# EAGLE design stm32f4discovery-daugherboard-v2 (EAGLE 6.2)
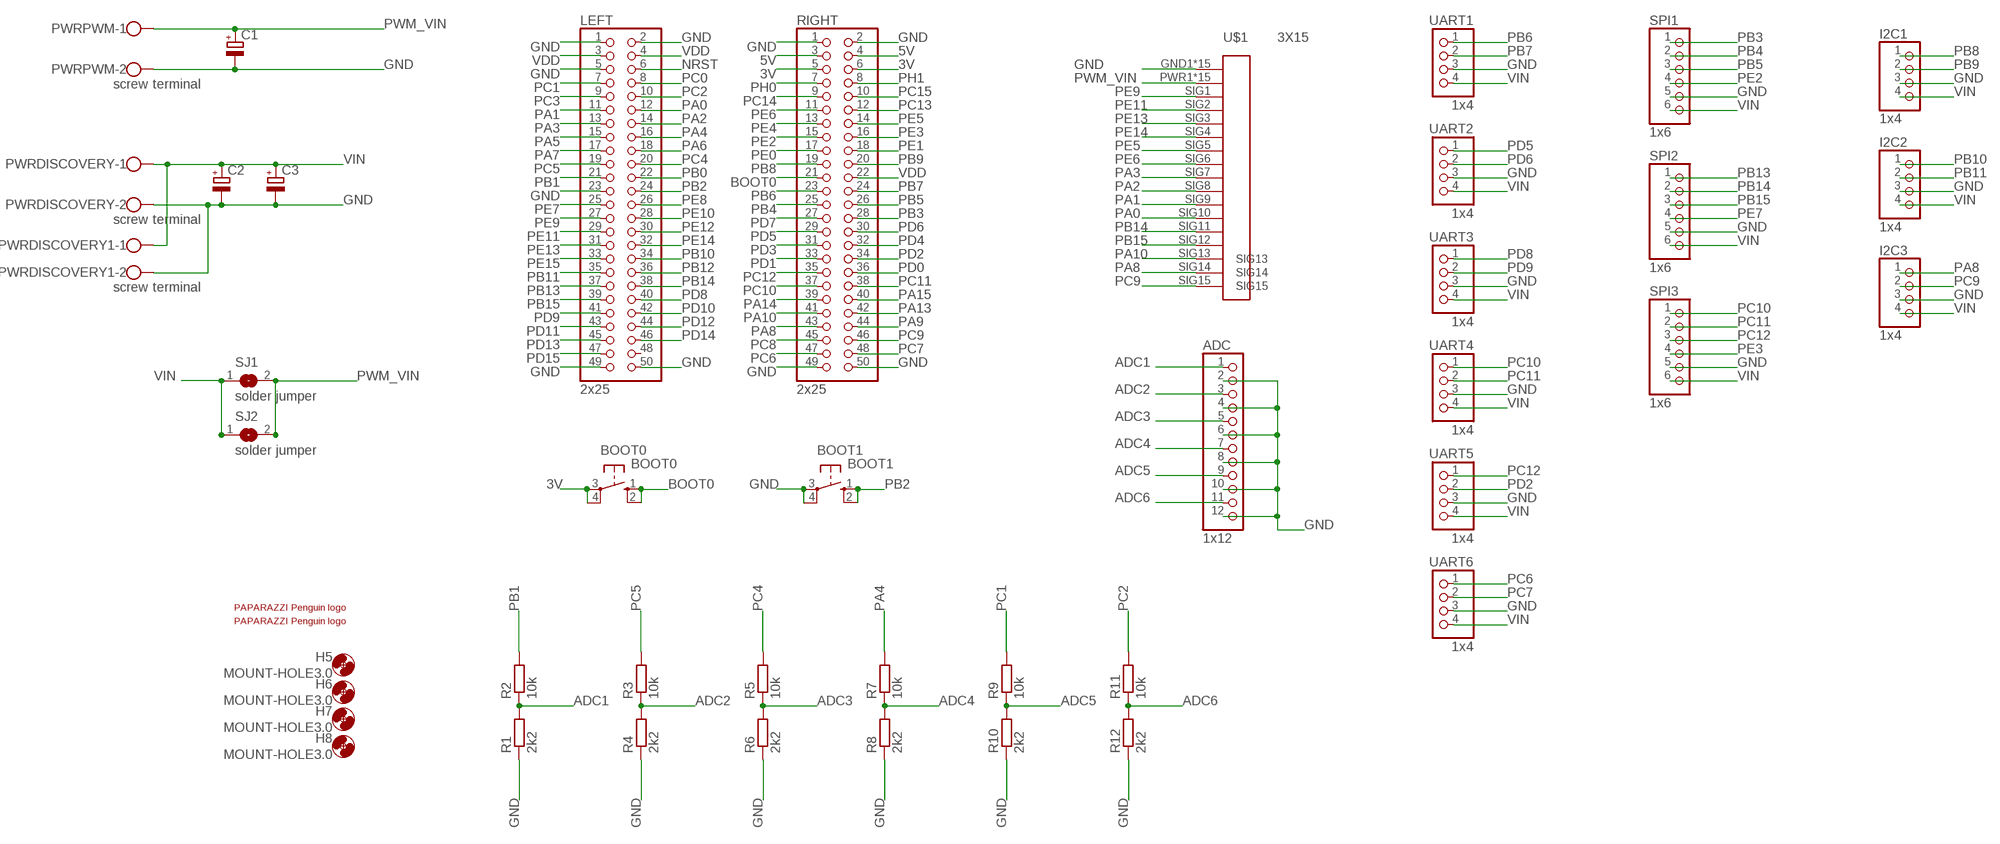
[diagram p0: schematic, sheet 1]

## Parts
ADC  1x12  PINHD-1X12/90  [1X12/90]
BOOT0  BOOT0  10-XX  [B3F-10XX]
BOOT1  BOOT1  10-XX  [B3F-10XX]
C1  CPOL-EU153CLV-0807  [153CLV-0807]
C2  CPOL-EU153CLV-0807  [153CLV-0807]
C3  CPOL-EU153CLV-0807  [153CLV-0807]
H5  MOUNT-HOLE3.0  [3,0]
H6  MOUNT-HOLE3.0  [3,0]
H7  MOUNT-HOLE3.0  [3,0]
H8  MOUNT-HOLE3.0  [3,0]
I2C1  1x4  PINHD-1X4/90  [1X04/90]
I2C2  1x4  PINHD-1X4/90  [1X04/90]
I2C3  1x4  PINHD-1X4/90  [1X04/90]
LEFT  2x25  PINHD-2X25  [2X25]
PWRDISCOVERY  screw terminal  W237-102  [W237-102]
PWRDISCOVERY1  screw terminal  W237-102  [W237-102]
PWRPWM  screw terminal  W237-102  [W237-102]
R1  2k2  R-EU_M0805  [M0805]
R2  10k  R-EU_M0805  [M0805]
R3  10k  R-EU_M0805  [M0805]
R4  2k2  R-EU_M0805  [M0805]
R5  10k  R-EU_M0805  [M0805]
R6  2k2  R-EU_M0805  [M0805]
R7  10k  R-EU_M0805  [M0805]
R8  2k2  R-EU_M0805  [M0805]
R9  10k  R-EU_M0805  [M0805]
R10  2k2  R-EU_M0805  [M0805]
R11  10k  R-EU_M0805  [M0805]
R12  2k2  R-EU_M0805  [M0805]
RIGHT  2x25  PINHD-2X25  [2X25]
SJ1  solder jumper  SJW  [SJW]
SJ2  solder jumper  SJW  [SJW]
SPI1  1x6  PINHD-1X6/90  [1X06/90]
SPI2  1x6  PINHD-1X6/90  [1X06/90]
SPI3  1x6  PINHD-1X6/90  [1X06/90]
U$1  3X15  [3X15]
U$2  PAPARAZZI  [PAPARAZZI]
U$3  PAPARAZZI  [PAPARAZZI]
UART1  1x4  PINHD-1X4/90  [1X04/90]
UART2  1x4  PINHD-1X4/90  [1X04/90]
UART3  1x4  PINHD-1X4/90  [1X04/90]
UART4  1x4  PINHD-1X4/90  [1X04/90]
UART5  1x4  PINHD-1X4/90  [1X04/90]
UART6  1x4  PINHD-1X4/90  [1X04/90]

## Nets
3V: BOOT0.3(P) BOOT0.4(P1) RIGHT.5 RIGHT.6
5V: RIGHT.3 RIGHT.4
ADC1: ADC.1 R1.2 R2.1
ADC2: ADC.3 R3.1 R4.2
ADC3: ADC.5 R5.1 R6.2
ADC4: ADC.7 R7.1 R8.2
ADC5: ADC.9 R9.1 R10.2
ADC6: ADC.11 R11.1 R12.2
BOOT0: BOOT0.1(S) BOOT0.2(S1) RIGHT.21
GND: ADC.2 ADC.4 ADC.6 ADC.8 ADC.10 ADC.12 BOOT1.3(P) BOOT1.4(P1) C1.- C2.- C3.- I2C1.3 I2C2.3 I2C3.3 LEFT.1 LEFT.2 LEFT.5 LEFT.23 LEFT.49 LEFT.50 PWRDISCOVERY1.2 PWRDISCOVERY.2 PWRPWM.2 R1.1 R4.1 R6.1 R8.1 R10.1 R12.1 RIGHT.1 RIGHT.2 RIGHT.49 RIGHT.50 SPI1.5 SPI2.5 SPI3.5 U$1.GND1(GND) U$1.GND2(GND) U$1.GND3(GND) U$1.GND4(GND) U$1.GND5(GND) U$1.GND6(GND) U$1.GND7(GND) U$1.GND8(GND) U$1.GND9(GND) U$1.GND10(GND) U$1.GND11(GND) U$1.GND12(GND) U$1.GND13(GND) U$1.GND14(GND) U$1.GND15(GND) UART1.3 UART2.3 UART3.3 UART4.3 UART5.3 UART6.3
NRST: LEFT.6
PA0: LEFT.12 U$1.SIG10
PA1: LEFT.11 U$1.SIG9
PA2: LEFT.14 U$1.SIG8
PA3: LEFT.13 U$1.SIG7
PA4: LEFT.16 R7.2
PA5: LEFT.15
PA6: LEFT.18
PA7: LEFT.17
PA8: I2C3.1 RIGHT.43 U$1.SIG14
PA9: RIGHT.44
PA10: RIGHT.41 U$1.SIG13
PA13: RIGHT.42
PA14: RIGHT.39
PA15: RIGHT.40
PB0: LEFT.22
PB1: LEFT.21 R2.2
PB2: BOOT1.1(S) BOOT1.2(S1) LEFT.24
PB3: RIGHT.28 SPI1.1
PB4: RIGHT.25 SPI1.2
PB5: RIGHT.26 SPI1.3
PB6: RIGHT.23 UART1.1
PB7: RIGHT.24 UART1.2
PB8: I2C1.1 RIGHT.19
PB9: I2C1.2 RIGHT.20
PB10: I2C2.1 LEFT.34
PB11: I2C2.2 LEFT.35
PB12: LEFT.36
PB13: LEFT.37 SPI2.1
PB14: LEFT.38 SPI2.2 U$1.SIG11
PB15: LEFT.39 SPI2.3 U$1.SIG12
PC0: LEFT.8
PC1: LEFT.7 R9.2
PC2: LEFT.10 R11.2
PC3: LEFT.9
PC4: LEFT.20 R5.2
PC5: LEFT.19 R3.2
PC6: RIGHT.47 UART6.1
PC7: RIGHT.48 UART6.2
PC8: RIGHT.45
PC9: I2C3.2 RIGHT.46 U$1.SIG15
PC10: RIGHT.37 SPI3.1 UART4.1
PC11: RIGHT.38 SPI3.2 UART4.2
PC12: RIGHT.35 SPI3.3 UART5.1
PC13: RIGHT.12
PC14: RIGHT.9
PC15: RIGHT.10
PD0: RIGHT.36
PD1: RIGHT.33
PD2: RIGHT.34 UART5.2
PD3: RIGHT.31
PD4: RIGHT.32
PD5: RIGHT.29 UART2.1
PD6: RIGHT.30 UART2.2
PD7: RIGHT.27
PD8: LEFT.40 UART3.1
PD9: LEFT.41 UART3.2
PD10: LEFT.42
PD11: LEFT.43
PD12: LEFT.44
PD13: LEFT.45
PD14: LEFT.46
PD15: LEFT.47
PE0: RIGHT.17
PE1: RIGHT.18
PE2: RIGHT.15 SPI1.4
PE3: RIGHT.16 SPI3.4
PE4: RIGHT.13
PE5: RIGHT.14 U$1.SIG5
PE6: RIGHT.11 U$1.SIG6
PE7: LEFT.25 SPI2.4
PE8: LEFT.26
PE9: LEFT.27 U$1.SIG1
PE10: LEFT.28
PE11: LEFT.29 U$1.SIG2
PE12: LEFT.30
PE13: LEFT.31 U$1.SIG3
PE14: LEFT.32 U$1.SIG4
PE15: LEFT.33
PH0: RIGHT.7
PH1: RIGHT.8
PWM_VIN: C1.+ PWRPWM.1 SJ1.2 SJ2.2 U$1.PWR1(PWR) U$1.PWR2(PWR) U$1.PWR3(PWR) U$1.PWR4(PWR) U$1.PWR5(PWR) U$1.PWR6(PWR) U$1.PWR7(PWR) U$1.PWR8(PWR) U$1.PWR9(PWR) U$1.PWR10(PWR) U$1.PWR11(PWR) U$1.PWR12(PWR) U$1.PWR13(PWR) U$1.PWR14(PWR) U$1.PWR15(PWR)
VDD: LEFT.3 LEFT.4 RIGHT.22
VIN: C2.+ C3.+ I2C1.4 I2C2.4 I2C3.4 PWRDISCOVERY1.1 PWRDISCOVERY.1 SJ1.1 SJ2.1 SPI1.6 SPI2.6 SPI3.6 UART1.4 UART2.4 UART3.4 UART4.4 UART5.4 UART6.4
Unconnected: LEFT.48

## Library data of the parts
ADC = pinhead:PINHD-1X12: PIN HEADER
BOOT0 BOOT1 = switch-omron:10-XX: OMRON SWITCH; MPN: B3F-1000; OC_FARNELL: 176432; OC_NEWARK: 36M3542
C1-C3 = rcl:CPOL-EU: POLARIZED CAPACITOR, European symbol
H5-H8 = holes:MOUNT-HOLE: MOUNTING HOLE with drill center marker
I2C1-I2C3 UART1-UART6 = pinhead:PINHD-1X4: PIN HEADER
LEFT RIGHT = pinhead:PINHD-2X25: PIN HEADER
PWRDISCOVERY PWRDISCOVERY1 PWRPWM = con-wago-500:W237-102: WAGO SCREW CLAMP; MPN: 237-102; OC_FARNELL: unknown; OC_NEWARK: 70K9898
R1-R12 = resistor:R-EU_: RESISTOR, European symbol
SJ1 SJ2 = jumper:SJ: SMD solder JUMPER
SPI1-SPI3 = pinhead:PINHD-1X6: PIN HEADER
U$1 = pinhead3:3X15
U$2 U$3 = paparazzi:PAPARAZZI

## Board
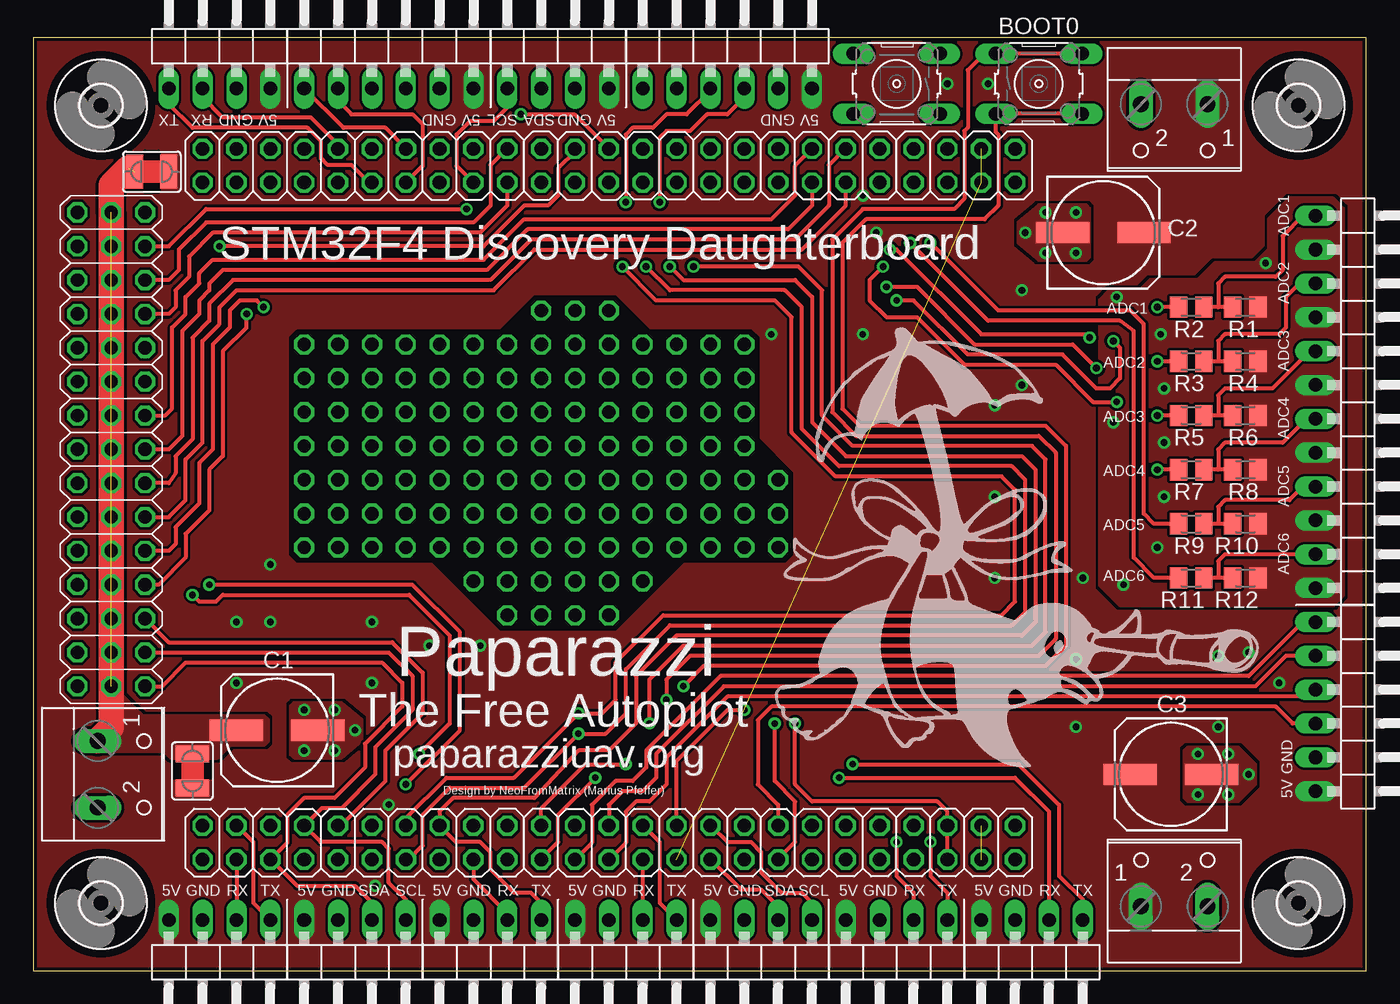
[diagram p1: board, top side]
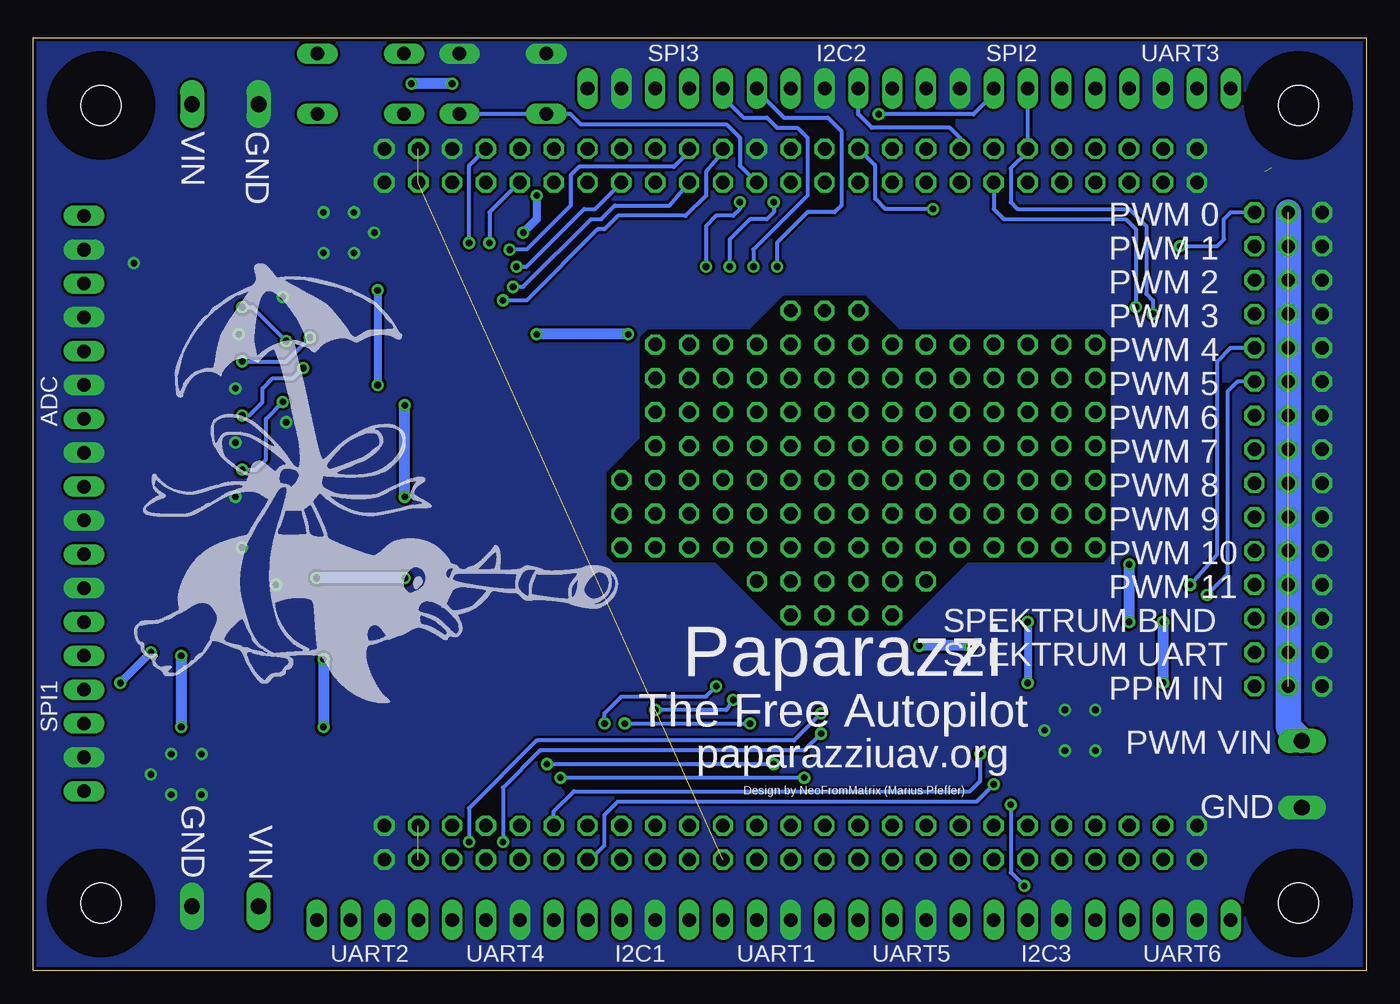
[diagram p2: board, bottom side, seen from below]

Size 100 x 70 mm. Coordinates in mm from the lower left corner, seen from the top.
Outline: 0,0 100,0 100,70 0,70 0,0
Copper layers (1*16): Top 0.035mm / dielectric 1.5mm / Bottom 0.035mm
Design rules: minimum track width 10mil, minimum drill 19mil, track to track 8mil, track to pad 8mil, pad to pad 8mil, via to via 8mil, smd to smd 8mil, copper to edge 10mil, drill to drill 8mil, minimum pad ring 10mil, minimum via ring 8mil, stop-mask expansion 4mil, vias tented up to drill 0mil, thermal gap 7mil

### Footprints (pad centres in the part's own frame; a part is rotated, then mirrored left to right if it is on the bottom)
1X12/90 = drill 1.016 long: 1 -13.97,-3.81; 2 -11.43,-3.81; 3 -8.89,-3.81; 4 -6.35,-3.81; 5 -3.81,-3.81; 6 -1.27,-3.81; 7 1.27,-3.81; 8 3.81,-3.81; 9 6.35,-3.81; 10 8.89,-3.81; 11 11.43,-3.81; 12 13.97,-3.81
B3F-10XX = drill 1.016 long: 1 -3.251,2.261; 2 3.251,2.261; 3 -3.251,-2.261; 4 3.251,-2.261
153CLV-0807 = smd 4 x 1.6: + 3.05,0; - -3.05,0
3,0 = hole 3: 0,0
1X04/90 = drill 1.016 long: 1 -3.81,-3.81; 2 -1.27,-3.81; 3 1.27,-3.81; 4 3.81,-3.81
2X25 = drill 1.016 octagon: 1 -30.48,-1.27; 2 -30.48,1.27; 3 -27.94,-1.27; 4 -27.94,1.27; 5 -25.4,-1.27; 6 -25.4,1.27; 7 -22.86,-1.27; 8 -22.86,1.27; 9 -20.32,-1.27; 10 -20.32,1.27; 11 -17.78,-1.27; 12 -17.78,1.27; 13 -15.24,-1.27; 14 -15.24,1.27; 15 -12.7,-1.27; 16 -12.7,1.27; 17 -10.16,-1.27; 18 -10.16,1.27; 19 -7.62,-1.27; 20 -7.62,1.27; 21 -5.08,-1.27; 22 -5.08,1.27; 23 -2.54,-1.27; 24 -2.54,1.27; 25 0,-1.27; 26 0,1.27; 27 2.54,-1.27; 28 2.54,1.27; 29 5.08,-1.27; 30 5.08,1.27; 31 7.62,-1.27; 32 7.62,1.27; 33 10.16,-1.27; 34 10.16,1.27; 35 12.7,-1.27; 36 12.7,1.27; 37 15.24,-1.27; 38 15.24,1.27; 39 17.78,-1.27; 40 17.78,1.27; 41 20.32,-1.27; 42 20.32,1.27; 43 22.86,-1.27; 44 22.86,1.27; 45 25.4,-1.27; 46 25.4,1.27; 47 27.94,-1.27; 48 27.94,1.27; 49 30.48,-1.27; 50 30.48,1.27
W237-102 = drill 1.194 long: 1 -2.5,-1.27; 2 2.5,-1.27
M0805 = smd 1.3 x 1.6: 1 -0.95,0; 2 0.95,0
SJW = smd 1.27 x 2.54: 1 -1.27,0; 2 1.27,0
1X06/90 = drill 1.016 long: 1 -6.35,-3.81; 2 -3.81,-3.81; 3 -1.27,-3.81; 4 1.27,-3.81; 5 3.81,-3.81; 6 6.35,-3.81
3X15 = drill 1 octagon: GND1 -17.78,-2.54; GND2 -15.24,-2.54; GND3 -12.7,-2.54; GND4 -10.16,-2.54; GND5 -7.62,-2.54; GND6 -5.08,-2.54; GND7 -2.54,-2.54; GND8 0,-2.54; GND9 2.54,-2.54; GND10 5.08,-2.54; GND11 7.62,-2.54; GND12 10.16,-2.54; GND13 12.7,-2.54; GND14 15.24,-2.54; GND15 17.78,-2.54; PWR1 -17.78,0; PWR2 -15.24,0; PWR3 -12.7,0; PWR4 -10.16,0; PWR5 -7.62,0; PWR6 -5.08,0; PWR7 -2.54,0; PWR8 0,0; PWR9 2.54,0; PWR10 5.08,0; PWR11 7.62,0; PWR12 10.16,0; PWR13 12.7,0; PWR14 15.24,0; PWR15 17.78,0; SIG1 -17.78,2.54; SIG2 -15.24,2.54; SIG3 -12.7,2.54; SIG4 -10.16,2.54; SIG5 -7.62,2.54; SIG6 -5.08,2.54; SIG7 -2.54,2.54; SIG8 0,2.54; SIG9 2.54,2.54; SIG10 5.08,2.54; SIG11 7.62,2.54; SIG12 10.16,2.54; SIG13 12.7,2.54; SIG14 15.24,2.54; SIG15 17.78,2.54

### Placement (x,y rotation side)
ADC  100,42.67 270 top
BOOT0  75.44,66.55 0 top
BOOT1  64.77,66.55 180 top
C1  18.29,18.03 180 top
C2  80.26,55.37 0 top
C3  85.34,14.73 180 top
H5  94.92,5.08 0 top
H6  5.08,5.08 0 top
H7  94.92,64.92 0 top
H8  5.08,64.92 0 top
I2C1  54.61,0 180 top
I2C2  39.37,70 0 top
I2C3  24.13,0 180 top
LEFT  43.18,60.4 180 top
PWRDISCOVERY  85.6,63.75 180 top
PWRDISCOVERY1  85.6,6.1 0 top
PWRPWM  6.1,14.73 270 top
R1  90.93,49.78 180 top
R2  86.87,49.78 180 top
R3  86.87,45.72 180 top
R4  90.93,45.72 180 top
R5  86.87,41.66 180 top
R6  90.93,41.66 180 top
R7  86.87,37.59 180 top
R8  90.93,37.59 180 top
R9  86.87,33.53 180 top
R10  90.93,33.53 180 top
R11  86.87,29.46 180 top
R12  90.93,29.46 180 top
RIGHT  43.18,9.6 180 top
SJ1  11.94,14.99 90 top
SJ2  8.89,59.94 180 top
SPI1  100,19.81 270 top
SPI2  26.67,70 0 top
SPI3  52.07,70 0 top
U$1  5.84,39.12 270 top
U$2  93.47,19.05 0 bottom
U$3  54.61,14.22 0 top
UART1  44.45,0 180 top
UART2  74.93,0 180 top
UART3  13.97,70 0 top
UART4  64.77,0 180 top
UART5  34.29,0 180 top
UART6  13.97,0 180 top

### Tracks (layer width: path | path; a pad name or v marks a point on that pad's centre or on a via)
3V  (via drill 0.5)
  Top 0.305: RIGHT.6 RIGHT.5 68.58,11.94 67.82,12.7 58.42,12.7 57.15,13.97 v57.15,18.54 | BOOT0.4 BOOT0.3 72.19,62.94 72.39,62.74 72.39,57.4 71.37,56.39 62.48,56.39 60.71,54.61 60.71,42.16 61.98,40.89 75.95,40.89 77.47,39.37 77.47,24.38 75.95,22.86 50.29,22.86 v48.77,21.34
  Bottom 0.305: v57.15,18.54 57.15,19.3 55.88,20.57 49.53,20.57 v48.77,21.34
5V  (1 unrouted)
ADC1
  Top 0.305: ADC.1 95.25,56.64 93.73,55.12 93.73,52.58 93.22,52.07 89.41,52.07 88.9,51.56 88.9,49.78 | 88.9,49.78 R2.1 | R1.2 88.9,49.78
ADC2
  Top 0.305: ADC.3 95,51.56 93.98,50.55 93.98,48.26 93.47,47.75 89.41,47.75 88.9,47.24 88.9,45.72 | 88.9,45.72 R3.1 | R4.2 88.9,45.72
ADC3
  Top 0.305: ADC.5 95.76,46.48 92.96,43.69 89.41,43.69 88.9,43.18 88.9,41.66 | 88.9,41.66 R5.1 | R6.2 88.9,41.66
ADC4
  Top 0.305: ADC.7 95.5,41.4 93.73,39.62 89.41,39.62 88.9,39.12 88.9,37.59 | 88.9,37.59 R7.1 | R8.2 88.9,37.59
ADC5
  Top 0.305: ADC.9 95.25,36.32 94.23,35.31 89.41,35.31 88.9,34.8 88.9,33.53 | 88.9,33.53 R9.1 | R10.2 88.9,33.53
ADC6
  Top 0.305: ADC.11 89.41,31.24 88.9,30.73 88.9,29.46 | 88.9,29.46 R11.1 | R12.2 88.9,29.46
BOOT0  (via drill 0.5)
  Top 0.305: RIGHT.21 48.26,15.75 52.07,19.56 v53.34,19.56 | BOOT0.2 BOOT0.1 71.35,68.81 70.1,67.56 70.1,63.25 69.85,62.99 69.85,57.91 69.09,57.15 62.23,57.15 59.94,54.86 59.94,41.91 61.72,40.13 75.44,40.13 76.71,38.86 76.71,24.89 75.44,23.62 49.28,23.62 47.5,21.84 v47.5,20.32
  Bottom 0.305: v47.5,20.32 48.01,19.56 v53.34,19.56
GND  (via drill 0.5)
  other vias: 24.13,18.03 22.61,19.56 22.61,16.51 20.32,19.56 20.32,16.51 78.23,56.9 75.95,56.9 74.42,55.37 75.95,53.85 78.23,53.85 81.79,28.96 84.33,31.75 84.84,35.56 84.84,39.62 81.03,41.15 84.84,43.69 84.58,47.75 81.28,50.55 87.38,16.26 87.38,13.21 89.66,13.21 91.19,14.73 89.66,16.26 92.46,53.09
  pour Top (no thermals): 79.25,53.59 79.25,57.15 78.99,57.4 75.44,57.4 73.91,56.13 73.91,54.61 75.44,53.34 78.99,53.34
  pour Top (no thermals): 19.3,19.81 19.3,16.26 19.56,16 23.11,16 24.64,17.27 24.64,18.8 23.11,20.07 19.56,20.07
  pour Top (no thermals): 98.3,57.15 97.54,57.91 94.23,57.91 92.71,56.39 92.71,54.1 91.69,53.09 88.65,53.09 87.38,51.82 83.82,51.82 83.06,51.05 80.77,51.05 80.01,50.29 80.01,28.96 81.53,27.43 97.54,27.43 98.3,28.19
  pour Bottom (rank 3, no thermals): 0,0 100.08,0 100.08,70.1 0,70.1
  pour Top (no thermals): 86.36,16.51 86.36,12.95 86.61,12.7 90.42,12.7 91.69,13.97 91.69,15.49 90.42,16.76 86.61,16.76
N$2
  cutout Top (rank 2): 10.41,15.49 10.41,14.48 13.46,14.48 13.46,15.49
N$4
  Top 1.676: 11.94,14.22 11.94,15.75
N$6
  Top 1.676: 8.13,59.94 9.65,59.94
N$12
  cutout Top (rank 2): 8.38,61.47 9.4,61.47 9.4,58.42 8.38,58.42
N$13  (via drill 1)
  other vias: 20.32,46.99
N$14
  cutout Top: 32.77,58.17 32.77,57.91 33.02,57.66 33.02,58.17
N$15
  cutout Top: 23.37,62.48 23.37,62.74 23.11,62.74
N$16  (via drill 1)
  other vias: 22.86,46.99
N$17
  cutout Bottom: 43.69,19.3 43.94,19.56 43.94,19.05
N$18
  cutout Bottom: 59.94,13.46 60.2,13.72 59.94,13.97
N$19
  cutout Bottom: 41.66,16 41.91,16.26 41.91,16
N$20
  cutout Bottom: 10.41,43.94 10.92,43.94 10.67,43.94 10.41,43.69
N$21
  cutout Bottom: 30.99,64.01 30.99,63.5 31.5,64.01
N$22  (via drill 1)
  other vias: 25.4,46.99
N$24  (via drill 1)
  other vias: 27.94,46.99
N$25  (via drill 1)
  other vias: 30.48,46.99
N$26  (via drill 1)
  other vias: 33.02,46.99
N$27  (via drill 1)
  other vias: 35.56,46.99
N$28  (via drill 1)
  other vias: 38.1,46.99
N$29  (via drill 1)
  other vias: 40.64,46.99
N$30  (via drill 1)
  other vias: 43.18,46.99
N$31  (via drill 1)
  other vias: 45.72,46.99
N$32  (via drill 1)
  other vias: 48.26,46.99
N$33  (via drill 1)
  other vias: 50.8,46.99
N$34  (via drill 1)
  other vias: 20.32,44.45
N$35  (via drill 1)
  other vias: 20.32,41.91
N$36  (via drill 1)
  other vias: 20.32,39.37
N$37  (via drill 1)
  other vias: 22.86,44.45
N$38  (via drill 1)
  other vias: 25.4,44.45
N$39  (via drill 1)
  other vias: 27.94,44.45
N$40  (via drill 1)
  other vias: 30.48,44.45
N$41  (via drill 1)
  other vias: 33.02,44.45
N$42  (via drill 1)
  other vias: 35.56,44.45
N$43  (via drill 1)
  other vias: 38.1,44.45
N$44  (via drill 1)
  other vias: 40.64,44.45
N$45  (via drill 1)
  other vias: 43.18,44.45
N$46  (via drill 1)
  other vias: 45.72,44.45
N$47  (via drill 1)
  other vias: 48.26,44.45
N$48  (via drill 1)
  other vias: 50.8,44.45
N$49  (via drill 1)
  other vias: 22.86,41.91
N$50  (via drill 1)
  other vias: 25.4,41.91
N$51  (via drill 1)
  other vias: 27.94,41.91
N$52  (via drill 1)
  other vias: 30.48,41.91
N$53  (via drill 1)
  other vias: 33.02,41.91
N$54  (via drill 1)
  other vias: 35.56,41.91
N$55  (via drill 1)
  other vias: 20.32,36.83
N$56  (via drill 1)
  other vias: 38.1,41.91
N$57  (via drill 1)
  other vias: 40.64,41.91
N$58  (via drill 1)
  other vias: 43.18,41.91
N$59  (via drill 1)
  other vias: 45.72,41.91
N$60  (via drill 1)
  other vias: 48.26,41.91
N$61  (via drill 1)
  other vias: 50.8,41.91
N$62  (via drill 1)
  other vias: 22.86,39.37
N$63  (via drill 1)
  other vias: 25.4,39.37
N$64  (via drill 1)
  other vias: 27.94,39.37
N$65  (via drill 1)
  other vias: 30.48,39.37
N$66  (via drill 1)
  other vias: 33.02,39.37
N$67  (via drill 1)
  other vias: 35.56,39.37
N$68  (via drill 1)
  other vias: 38.1,39.37
N$69  (via drill 1)
  other vias: 40.64,39.37
N$70  (via drill 1)
  other vias: 43.18,39.37
N$71  (via drill 1)
  other vias: 45.72,39.37
N$72  (via drill 1)
  other vias: 48.26,39.37
N$73  (via drill 1)
  other vias: 50.8,39.37
N$74  (via drill 1)
  other vias: 22.86,36.83
N$75  (via drill 1)
  other vias: 25.4,36.83
N$76  (via drill 1)
  other vias: 27.94,36.83
N$77  (via drill 1)
  other vias: 30.48,36.83
N$78  (via drill 1)
  other vias: 33.02,36.83
N$79  (via drill 1)
  other vias: 35.56,36.83
N$80  (via drill 1)
  other vias: 38.1,36.83
N$81  (via drill 1)
  other vias: 40.64,36.83
N$82  (via drill 1)
  other vias: 43.18,36.83
N$83  (via drill 1)
  other vias: 45.72,36.83
N$84  (via drill 1)
  other vias: 48.26,36.83
N$85  (via drill 1)
  other vias: 50.8,36.83
N$86  (via drill 1)
  other vias: 20.32,34.29
N$87  (via drill 1)
  other vias: 22.86,34.29
N$88  (via drill 1)
  other vias: 25.4,34.29
N$89  (via drill 1)
  other vias: 27.94,34.29
N$90  (via drill 1)
  other vias: 30.48,34.29
N$91  (via drill 1)
  other vias: 33.02,34.29
N$92  (via drill 1)
  other vias: 35.56,34.29
N$93  (via drill 1)
  other vias: 38.1,34.29
N$94  (via drill 1)
  other vias: 40.64,34.29
N$95  (via drill 1)
  other vias: 43.18,34.29
N$96  (via drill 1)
  other vias: 45.72,34.29
N$97  (via drill 1)
  other vias: 48.26,34.29
N$98  (via drill 1)
  other vias: 50.8,34.29
N$99  (via drill 1)
  other vias: 20.32,31.75
N$100  (via drill 1)
  other vias: 22.86,31.75
N$101  (via drill 1)
  other vias: 25.4,31.75
N$102  (via drill 1)
  other vias: 27.94,31.75
N$103  (via drill 1)
  other vias: 30.48,31.75
N$104  (via drill 1)
  other vias: 33.02,31.75
N$105  (via drill 1)
  other vias: 35.56,31.75
N$106  (via drill 1)
  other vias: 38.1,31.75
N$107  (via drill 1)
  other vias: 40.64,31.75
N$108  (via drill 1)
  other vias: 43.18,31.75
N$109  (via drill 1)
  other vias: 45.72,31.75
N$110  (via drill 1)
  other vias: 48.26,31.75
N$111  (via drill 1)
  other vias: 50.8,31.75
N$112  (via drill 1)
  other vias: 53.34,46.99
N$113  (via drill 1)
  other vias: 53.34,44.45
N$114  (via drill 1)
  other vias: 53.34,41.91
N$115  (via drill 1)
  other vias: 53.34,39.37
N$116  (via drill 1)
  other vias: 53.34,36.83
N$117  (via drill 1)
  other vias: 53.34,34.29
N$118  (via drill 1)
  other vias: 53.34,31.75
N$119  (via drill 1)
  other vias: 55.88,34.29
N$120
  cutout Top: 19.81,30.73 29.97,30.73 35.05,25.65 43.69,25.65 48.77,30.73 56.39,30.73 56.9,31.24 56.9,37.34 54.36,39.88 54.36,47.5 53.85,48.01 46.23,48.01 43.69,50.55 37.59,50.55 35.05,48.01 19.81,48.01 19.3,47.5 19.3,31.24
N$121
  cutout Bottom: 19.81,48.01 19.3,47.5 19.3,31.24 19.81,30.73 29.97,30.73 35.05,25.65 43.69,25.65 48.77,30.73 56.39,30.73 56.9,31.24 56.9,37.34 54.36,39.88 54.36,47.5 53.85,48.01 46.23,48.01 43.69,50.55 37.59,50.55 35.05,48.01
N$122  (via drill 1)
  other vias: 35.56,26.67
N$123  (via drill 1)
  other vias: 38.1,26.67
N$124  (via drill 1)
  other vias: 40.64,26.67
N$125  (via drill 1)
  other vias: 55.88,31.75
N$126  (via drill 1)
  other vias: 43.18,26.67
N$127  (via drill 1)
  other vias: 38.1,49.53
N$128  (via drill 1)
  other vias: 33.02,29.21
N$129  (via drill 1)
  other vias: 35.56,29.21
N$130  (via drill 1)
  other vias: 38.1,29.21
N$131  (via drill 1)
  other vias: 40.64,29.21
N$132  (via drill 1)
  other vias: 43.18,29.21
N$133  (via drill 1)
  other vias: 45.72,29.21
N$134  (via drill 1)
  other vias: 40.64,49.53
N$135  (via drill 1)
  other vias: 43.18,49.53
N$138  (via drill 1)
  other vias: 55.88,36.83
PA0
  Top 0.305: U$1.SIG10 10.16,34.04 11.43,35.31 11.43,38.35 12.7,39.62 12.7,47.24 13.97,48.51 13.97,49.78 15.24,51.05 34.54,51.05 37.59,54.1 57.66,54.1 60.96,57.4 LEFT.12
PA1
  Top 0.305: 60.91,61.67 59.69,60.45 59.69,57.4 57.15,54.86 37.34,54.86 34.29,51.82 14.99,51.82 13.21,50.04 13.21,48.77 11.94,47.5 11.94,39.88 10.67,38.61 10.67,37.34 10.16,36.58 U$1.SIG9
  Top 0.406: LEFT.11 60.91,61.67
PA2
  Top 0.305: LEFT.14 58.42,57.4 56.64,55.63 37.08,55.63 34.04,52.58 14.22,52.58 13.21,51.56 13.21,51.05 12.45,50.29 12.45,49.28 11.18,48.01 11.18,40.13 10.16,39.12 U$1.SIG8
PA3
  Top 0.305: U$1.SIG7 9.91,41.66 10.41,42.16 10.41,48.26 11.43,49.28 11.43,50.55 12.45,51.56 12.45,52.32 13.46,53.34 33.78,53.34 36.83,56.39 55.37,56.39 57.15,58.17 57.15,60.4 LEFT.13
PA4  (via drill 0.5)
  Top 0.305: R7.2 v84.33,37.59 | v63.75,52.83 62.74,51.82 62.74,50.29 64.01,49.02 66.29,49.02 69.85,45.47 76.71,45.47 79.5,42.67 v81.28,42.67
  Bottom 0.305: v84.33,37.59 83.31,37.59 82.55,38.35 82.55,41.4 v81.28,42.67 | v63.75,52.83 62.99,52.83 58.67,57.15 57.86,57.15 LEFT.16
PA8
  Top 0.305: I2C3.1 27.94,5.33 26.67,6.6 26.67,9.14 26.16,9.65 21.54,9.65 RIGHT.43 21.64,12.19 23.11,12.19 25.65,14.73 25.65,16.76 28.45,19.56 28.45,22.1 26.67,23.88 U$1.SIG14
PA10
  Top 0.305: U$1.SIG13 10.16,24.64 26.92,24.64 29.21,22.35 29.21,19.3 26.42,16.51 26.42,14.22 23.06,10.87 RIGHT.41
PB1  (via drill 0.5)
  Top 0.305: R2.2 v84.33,49.78 | v81.03,47.24 81.53,46.74 81.53,44.45 80.77,43.69 79.76,43.69 77.22,46.23 70.1,46.23 66.04,50.29 v64.77,50.29
  Bottom 0.305: v84.33,49.78 83.57,49.78 v81.03,47.24 | LEFT.21 48.26,61.47 49.53,59.94 49.53,58.17 51.05,56.64 56.13,56.64 57.15,55.63 57.66,55.63 62.99,50.29 v64.77,50.29
PB2
  Bottom 0.305: BOOT1.1 BOOT1.2 59.72,64.29 58.93,63.5 48.01,63.5 46.99,62.48 46.99,60.4 LEFT.24
PB3
  Top 0.305: SPI1.1 95.25,26.16 91.19,22.1 51.56,22.1 45.97,16.51 45.97,15.24 44.96,14.22 43.69,14.22 41.91,12.45 41.91,9.6 RIGHT.28
PB4
  Top 0.305: SPI1.2 93.98,23.62 91.69,21.34 51.82,21.34 46.74,16.26 46.74,14.48 45.72,13.46 44.2,13.46 43.18,12.45 RIGHT.25
PB5
  Top 0.305: SPI1.3 96.01,21.08 95.5,20.57 52.07,20.57 47.5,16 47.5,13.97 46.23,12.7 45.21,12.7 44.45,11.94 44.45,9.6 RIGHT.26
PB6
  Top 0.305: RIGHT.23 45.77,10.87 46.99,9.65 46.99,5.08 UART1.1
PB7
  Top 0.305: RIGHT.24 UART1.2
PB8
  Top 0.305: RIGHT.19 50.85,10.87 52.07,9.65 53.85,9.65 54.61,8.89 54.61,7.37 56.13,5.84 57.66,5.84 58.42,5.08 I2C1.1
PB9
  Top 0.305: RIGHT.20 50.85,8.33 53.09,6.1 54.61,6.1 55.88,4.83 I2C1.2
PB10
  Top 0.305: I2C2.1 35.56,64.77 34.54,63.75 32.77,63.75 31.75,62.74 31.75,60.4 LEFT.34
PB11
  Bottom 0.305: LEFT.35 30.48,62.48 31.24,63.25 37.08,63.25 38.1,64.26 I2C2.2
PB13
  Top 0.305: LEFT.37 27.94,61.72 26.42,63.25 23.26,63.25 SPI2.1
PB14  (via drill 0.5)
  Top 0.305: SPI2.2 22.86,65.28 23.88,64.26 28.45,64.26 29.21,63.5 29.21,60.4 LEFT.38 | v17.27,49.78 16.76,50.29 15.49,50.29 14.73,49.53 14.73,48.26 13.46,46.99 13.46,39.12 12.45,38.1 12.45,35.05 10.67,33.27 10.67,32 10.16,31.5 U$1.SIG11
  Bottom 0.305: LEFT.38 27.94,57.15 27.18,56.39 18.03,56.39 17.27,55.63 v17.27,49.78
PB15  (via drill 0.5)
  Top 0.305: U$1.SIG12 9.4,28.96 11.43,30.99 11.43,32.77 13.21,34.54 13.21,37.59 14.22,38.61 14.22,46.48 16,48.26 v16,49.28
  Bottom 0.305: SPI2.3 LEFT.39 25.4,61.47 26.67,60.2 26.67,57.66 26.16,57.15 17.78,57.15 16.51,55.88 16.51,50.8 16,50.29 v16,49.28
PC1  (via drill 0.5)
  Top 0.305: R9.2 84.07,33.53 83.31,34.29 83.31,48.51 82.3,49.53 72.39,49.53 v67.31,54.61
  Bottom 0.305: v67.31,54.61 67.31,60.4 LEFT.7
PC2  (via drill 0.5)
  Top 0.305: R11.2 84.07,29.46 82.55,30.99 82.55,48.01 81.53,48.77 71.63,48.77 v65.79,54.61
  Bottom 0.305: LEFT.10 63.55,59.13 65.79,56.9 v65.79,54.61
PC4  (via drill 0.5)
  Top 0.305: R5.2 v84.33,41.66 | v64.01,51.31 66.29,51.31 70.61,46.99 77.98,46.99 v79.76,45.21
  Bottom 0.305: v84.33,41.66 83.82,41.66 82.8,42.67 82.8,43.69 82.04,44.45 80.52,44.45 v79.76,45.21 | v64.01,51.31 63.25,51.31 58.17,56.39 57.4,56.39 56.39,57.4 52.27,57.4 LEFT.20
PC5  (via drill 0.5)
  Top 0.305: R3.2 v84.33,45.72 | v64.26,54.1 64.77,54.1 71.12,47.75 78.99,47.75 v79.25,47.5
  Bottom 0.305: v84.33,45.72 81.03,45.72 v79.25,47.5 | LEFT.19 50.8,61.47 51.94,60.33 59.05,60.33 59.69,59.69 59.69,57.4 62.99,54.1 v64.26,54.1
PC6
  Top 0.305: RIGHT.47 15.29,10.87 16.51,9.65 16.51,5.08 UART6.1
PC7
  Top 0.305: RIGHT.48 UART6.2
PC9
  Top 0.305: I2C3.2 25.4,5.08 24.13,6.35 19.81,6.35 17.83,8.33 RIGHT.46 19.05,9.6 19.05,11.68 20.32,12.95 22.61,12.95 24.89,15.24 24.89,17.02 27.69,19.81 27.69,21.59 26.16,23.11 11.43,23.11 9.65,21.34 U$1.SIG15
PC10  (via drill 0.5)
  Top 0.305: RIGHT.37 27.94,11.43 30.99,14.48 36.07,14.48 v40.89,19.3 42.67,19.3 43.69,20.32 43.69,23.11 47.24,26.67 72.64,26.67 73.66,27.69 73.66,36.07 72.64,37.08 60.2,37.08 56.9,40.39 56.9,49.02 55.63,50.29 46.74,50.29 v44.2,52.83 | v67.31,9.65 67.31,7.11 68.58,5.84 UART4.1
  Bottom 0.305: v44.2,52.83 44.2,54.61 41.91,56.9 39.88,56.9 39.37,57.4 39.37,62.99 40.39,64.01 43.69,64.01 45.72,66.04 SPI3.1 | v40.89,19.3 42.93,17.27 62.23,17.27 67.31,12.19 v67.31,9.65
PC11  (via drill 0.5)
  Top 0.305: RIGHT.38 28.14,8.33 29.21,9.4 29.21,11.68 31.24,13.72 36.83,13.72 v40.89,17.78 42.93,17.78 44.45,19.3 44.45,22.61 47.75,25.91 73.41,25.91 74.42,26.92 74.42,36.83 73.41,37.85 60.45,37.85 57.66,40.64 57.66,49.78 56.39,51.05 47.75,51.05 v45.97,52.83 | v64.77,9.65 64.77,7.11 66.04,5.84 UART4.2
  Bottom 0.305: v45.97,52.83 45.97,54.1 41.91,58.17 41.91,62.48 42.67,63.25 44.2,63.25 44.96,64.01 46.74,64.01 48.26,65.53 SPI3.2 | v40.89,17.78 42.16,16.51 61.98,16.51 64.77,13.72 v64.77,9.65
PC12  (via drill 0.5)
  Top 0.305: SPI3.3 50.8,66.04 49.02,64.26 47.5,64.26 46.48,63.25 44.96,63.25 44.45,62.74 v44.45,57.66 | v47.75,52.83 48.77,51.82 57.15,51.82 58.42,50.55 58.42,41.15 60.96,38.61 74.17,38.61 75.18,37.59 75.18,26.16 74.17,25.15 48.26,25.15 45.21,22.1 45.21,18.54 43.18,16.51 40.89,16.51 37.59,12.95 31.5,12.95 30.48,11.94 RIGHT.35 31.7,9.65 33.53,9.65 34.29,8.89 34.29,7.62 36.07,5.84 37.34,5.84 38.1,5.08 UART5.1
  Bottom 0.305: v44.45,57.66 44.45,56.9 44.96,56.39 46.23,56.39 47.75,54.86 v47.75,52.83
PD2
  Top 0.305: RIGHT.34 33.02,6.86 35.56,4.32 UART5.2
PD5  (via drill 0.5)
  Top 0.305: RIGHT.29 38.1,12.19 41.4,15.49 v44.45,15.49 | v61.47,15.49 73.91,15.49 76.96,12.45 76.96,7.11 78.74,5.33 UART2.1
  Bottom 0.305: v44.45,15.49 v61.47,15.49
PD6  (via drill 0.5)
  Top 0.305: RIGHT.30 38.1,8.38 39.37,9.65 39.37,11.68 v42.16,14.48 | v60.45,14.48 73.66,14.48 76.2,11.94 UART2.2
  Bottom 0.305: v42.16,14.48 v60.45,14.48
PD8
  Top 0.305: LEFT.40 25.2,59.13 23.88,60.45 22.1,60.45 21.59,60.96 21.59,62.23 20.57,63.25 11.94,63.25 10.16,65.02 UART3.1
PD9
  Top 0.305: LEFT.41 22.86,61.98 20.83,64.01 14.22,64.01 12.7,65.53 UART3.2
PE2
  Top 0.305: SPI1.4 94.49,18.54 93.22,19.81 55.37,19.81 54.36,18.8 54.36,13.97 55.88,12.45 RIGHT.15
PE3  (via drill 0.5)
  Top 0.305: RIGHT.16 55.88,8.38 57.15,9.65 57.15,12.7 55.63,14.22 v55.63,18.54 | SPI3.4 53.34,65.53 52.07,64.26 50.55,64.26 49.28,62.99 47.5,62.99 46.99,62.48 v46.99,57.66 | v46.23,18.54 46.23,21.84 48.77,24.38 74.93,24.38 75.95,25.4 75.95,38.35 74.93,39.37 61.47,39.37 59.18,41.66 59.18,51.05 57.4,52.83 v49.53,52.83
  Bottom 0.305: v46.99,57.66 46.99,57.15 47.5,56.64 48.77,56.64 49.53,55.88 v49.53,52.83 | v55.63,18.54 v46.23,18.54
PE5  (via drill 0.5)
  Top 0.305: v27.94,13.97 32,18.03 32,25.4 28.45,28.96 v13.21,28.96
  Bottom 0.305: 58.22,8.33 57.15,9.4 57.15,11.68 56.13,12.7 29.21,12.7 v27.94,13.97 | v13.21,28.96 11.18,31.24 11.18,45.72 10.16,46.74 U$1.SIG5
  Bottom 0.406: RIGHT.14 58.22,8.33
PE6  (via drill 0.5)
  Top 0.305: v11.94,28.19 12.45,27.69 13.72,27.69 14.22,28.19 28.19,28.19 31.24,25.15 31.24,18.54 v28.96,16.26
  Bottom 0.305: U$1.SIG6 9.65,44.2 10.41,43.43 10.41,29.72 v11.94,28.19 | RIGHT.11 60.96,11.94 59.44,13.46 29.72,13.46 28.96,14.22 v28.96,16.26
PE7  (via drill 0.5)
  Top 0.305: v36.58,64.26 40.59,64.26 LEFT.25
  Bottom 0.305: SPI2.4 27.94,65.79 29.46,64.26 v36.58,64.26
PE9  (via drill 0.5)
  Top 0.305: LEFT.27 40.64,61.47 39.37,60.2 39.37,58.17 38.61,57.4 36.83,57.4 33.78,54.36 v13.97,54.36
  Bottom 0.305: v13.97,54.36 11.18,54.36 10.67,54.86 10.67,56.39 10.16,56.9 U$1.SIG1
PE11  (via drill 0.5)
  Top 0.305: U$1.SIG2 10.16,54.36 12.95,57.15 v32.51,57.15
  Bottom 0.305: v32.51,57.15 36.07,57.15 36.83,57.91 36.83,60.4 LEFT.29
PE13
  Top 0.305: LEFT.31 35.51,61.67 34.29,60.45 34.29,57.4 33.02,56.13 12.95,56.13 10.92,54.1 10.92,52.58 10.16,51.82 U$1.SIG3
PE14
  Top 0.305: LEFT.32 35.56,57.4 33.53,55.37 13.46,55.37 11.68,53.59 11.68,52.07 10.67,51.05 10.67,49.78 10.16,49.28 U$1.SIG4
PWM_VIN  (15 unrouted)
  Top 1.93: 7.11,60.2 5.84,58.93 U$1.PWR1 5.84,18.25 PWRPWM.1
  Bottom 1.93: U$1.PWR1 5.84,18.29 4.83,17.27
  pour Top (no thermals): 4.83,16.51 9.91,16.51 10.41,16 13.72,16 14.73,17.02 17.27,17.02 17.53,17.27 17.53,18.8 17.27,19.05 8.13,19.05 6.6,20.57 6.1,20.07 6.1,18.54 4.83,17.27
VDD  (2 unrouted)
VIN  (via drill 0.5)
  Bottom 0.305: v26.67,12.45 26.67,7.37 v25.65,6.35
  Bottom 0.61: v93.47,21.59 v91.19,23.88 | v25.4,26.16 v25.4,21.59 | v62.23,58.17 62.23,56.39 v63.25,55.37 | v74.17,51.05 v74.17,43.94
  Bottom 0.813: v68.58,66.55 v71.63,66.55 | v78.23,23.37 v78.23,18.29 | v88.9,23.62 v88.9,18.29 | v72.14,29.46 v78.74,29.46 | v72.14,35.56 v72.14,42.42 | v55.37,47.75 v62.23,47.75 | v15.24,26.16 v15.24,21.59 | v17.78,26.16 v17.78,30.48 | v29.72,24.38 v33.53,24.38
  pour Top (rank 2, no thermals): 0,0 100.08,0 100.08,70.1 0,70.1

### Text on the board
tNames: TODO: Sikscreen on both sides ! | TX | RX | GND | 5V | GND | 5V | SCL | SDA | GND | 5V | GND | 5V | ADC1 | STM32F4 Discovery Daughterboard | ADC2 | ADC1 | ADC2 | ADC3 | ADC3 | ADC4 | ADC4 | ADC5 | ADC5 | ADC6 | ADC6 | Paparazzi | The Free Autopilot | paparazziuav.org | GND | Design by NeoFromMatrix (Marius Pfeffer) | 5V | 5V | GND | RX | TX | 5V | GND | SDA | SCL | 5V | GND | RX | TX | 5V | GND | RX | TX | 5V | GND | SDA | SCL | 5V | GND | RX | TX | 5V | GND | RX | TX
bNames: GND | VIN | PWM 0 | PWM 1 | PWM 2 | PWM 3 | PWM 4 | PWM 5 | PWM 6 | PWM 7 | PWM 8 | PWM 9 | PWM 10 | PWM 11 | SPEKTRUM BIND | SPEKTRUM UART | Paparazzi | PPM IN | The Free Autopilot | PWM VIN | paparazziuav.org | Design by NeoFromMatrix (Marius Pfeffer) | GND | GND | VIN